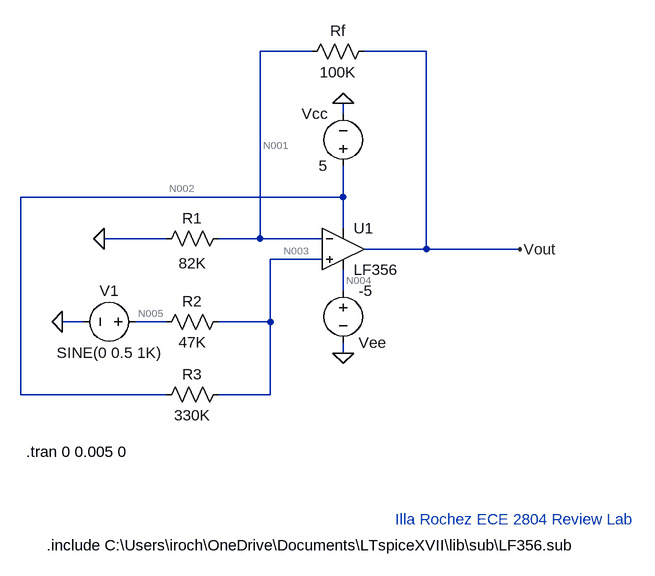
[diagram p0: schematic review_amps_complicated.asc]
review_amps_complicated.asc, the LTspice schematic file:
Version 4
SHEET 1 880 712
WIRE 352 -64 272 -64
WIRE 528 -64 432 -64
WIRE 400 32 400 16
WIRE 400 160 400 112
WIRE 400 160 -96 160
WIRE 400 208 400 160
WIRE 128 224 32 224
WIRE 272 224 272 -64
WIRE 272 224 208 224
WIRE 368 224 272 224
WIRE 528 240 528 -64
WIRE 528 240 432 240
WIRE 672 240 528 240
WIRE 368 256 288 256
WIRE 400 304 400 272
WIRE 0 352 -32 352
WIRE 128 352 80 352
WIRE 288 352 288 256
WIRE 288 352 208 352
WIRE 400 400 400 384
WIRE -96 464 -96 160
WIRE 128 464 -96 464
WIRE 288 464 288 352
WIRE 288 464 208 464
FLAG 32 224 0
FLAG 400 16 0
FLAG 400 400 0
FLAG -32 352 0
FLAG 672 240 Vout
SYMBOL res 224 208 R90
WINDOW 0 0 56 VBottom 2
WINDOW 3 38 56 VTop 2
SYMATTR InstName R1
SYMATTR Value 82K
SYMBOL res 224 336 R90
WINDOW 0 0 56 VBottom 2
WINDOW 3 32 56 VTop 2
SYMATTR InstName R2
SYMATTR Value 47K
SYMBOL res 224 448 R90
WINDOW 0 0 56 VBottom 2
WINDOW 3 32 56 VTop 2
SYMATTR InstName R3
SYMATTR Value 330K
SYMBOL res 448 -80 R90
WINDOW 0 0 56 VBottom 2
WINDOW 3 32 56 VTop 2
SYMATTR InstName Rf
SYMATTR Value 100K
SYMBOL voltage 96 352 R90
WINDOW 0 -32 56 VBottom 2
WINDOW 3 32 56 VTop 2
WINDOW 123 0 0 Left 0
WINDOW 39 0 0 Left 0
SYMATTR InstName V1
SYMATTR Value SINE(0 0.5 1K)
SYMBOL voltage 400 128 R180
WINDOW 0 24 96 Left 2
WINDOW 3 24 16 Left 2
WINDOW 123 0 0 Left 0
WINDOW 39 0 0 Left 0
SYMATTR InstName Vcc
SYMATTR Value 5
SYMBOL voltage 400 288 R0
WINDOW 0 24 96 Left 2
WINDOW 3 24 16 Left 2
WINDOW 123 0 0 Left 0
WINDOW 39 0 0 Left 0
SYMATTR InstName Vee
SYMATTR Value -5
SYMBOL Opamps\\opamp2 400 176 R0
SYMATTR InstName U1
SYMATTR Value LF356
TEXT -56 696 Left 2 !.include C:\\Users\\iroch\\OneDrive\\Documents\\LTspiceXVII\\lib\\sub\\LF356.sub
TEXT 480 656 Left 2 ;Illa Rochez ECE 2804 Review Lab
TEXT -88 552 Left 2 !.tran 0 0.005 0

The netlist it stands for:
* review_amps_complicated.asc
R1 N001 0 82K
R2 N003 N005 47K
R3 N003 N002 330K
Rf Vout N001 100K
V1 N005 0 SINE(0 0.5 1K)
Vcc N002 0 5
Vee N004 0 -5
XU1 N003 N001 N002 N004 Vout LF356  ; pins In+ In- V+ V- OUT
.include C:\Users\iroch\OneDrive\Documents\LTspiceXVII\lib\sub\LF356.sub
* Illa Rochez ECE 2804 Review Lab
.tran 0 0.005 0
.backanno
.end

* Results of the author's LTspice run, read from the files saved beside the schematic
* Operating Point, zero values left out:
*   V(n001) = 626.3 mV
*   V(n003) = 623.3 mV
*   V(n002) = 5 V
*   V(vout) = 1.39 V
*   V(n004) = -5 V
*   I(Rf) = 7.638 µA
*   I(R3) = -13.26 µA
*   I(R2) = 13.26 µA
*   I(R1) = 7.638 µA
*   I(Vee) = 4.85 mA
*   I(Vcc) = -4.871 mA
*   I(V1) = 13.26 µA
*   Ix(u1:1) = 31.63 pA
*   Ix(u1:2) = 37.62 pA
*   Ix(u1:99) = 4.858 mA
*   Ix(u1:50) = -4.85 mA
*   Ix(u1:28) = -7.638 µA
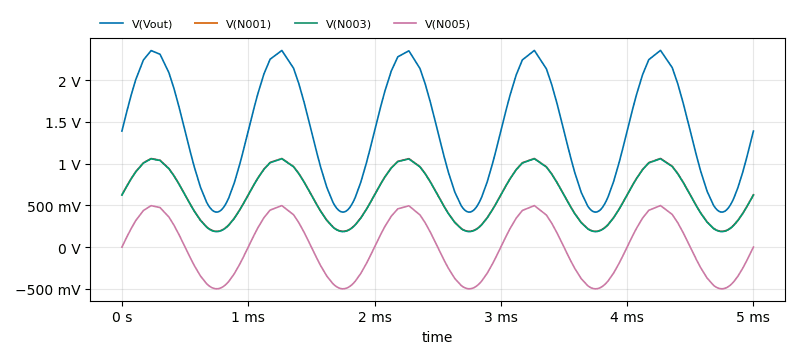
[diagram p1: Transient Analysis of review_amps_complicated.asc, plotted from the saved traces]
* Transient Analysis, 1 run:
*   V(Vout): min 419 mV, max 2.357 V, average 1.386 V, rms 1.545 V, last 1.39 V
*   V(N001): min 188.9 mV, max 1.062 V, average 624.4 mV, rms 696 mV, last 626.2 mV
*   V(N003): min 185.9 mV, max 1.059 V, average 621.4 mV, rms 693.3 mV, last 623.3 mV
*   V(N005): min -499.9 mV, max 497.7 mV, average -2.161 mV, rms 351.3 mV, last 0 V